# EAGLE design Jacdac_3D_Magnetometer-RevB (EAGLE 9.6.2)
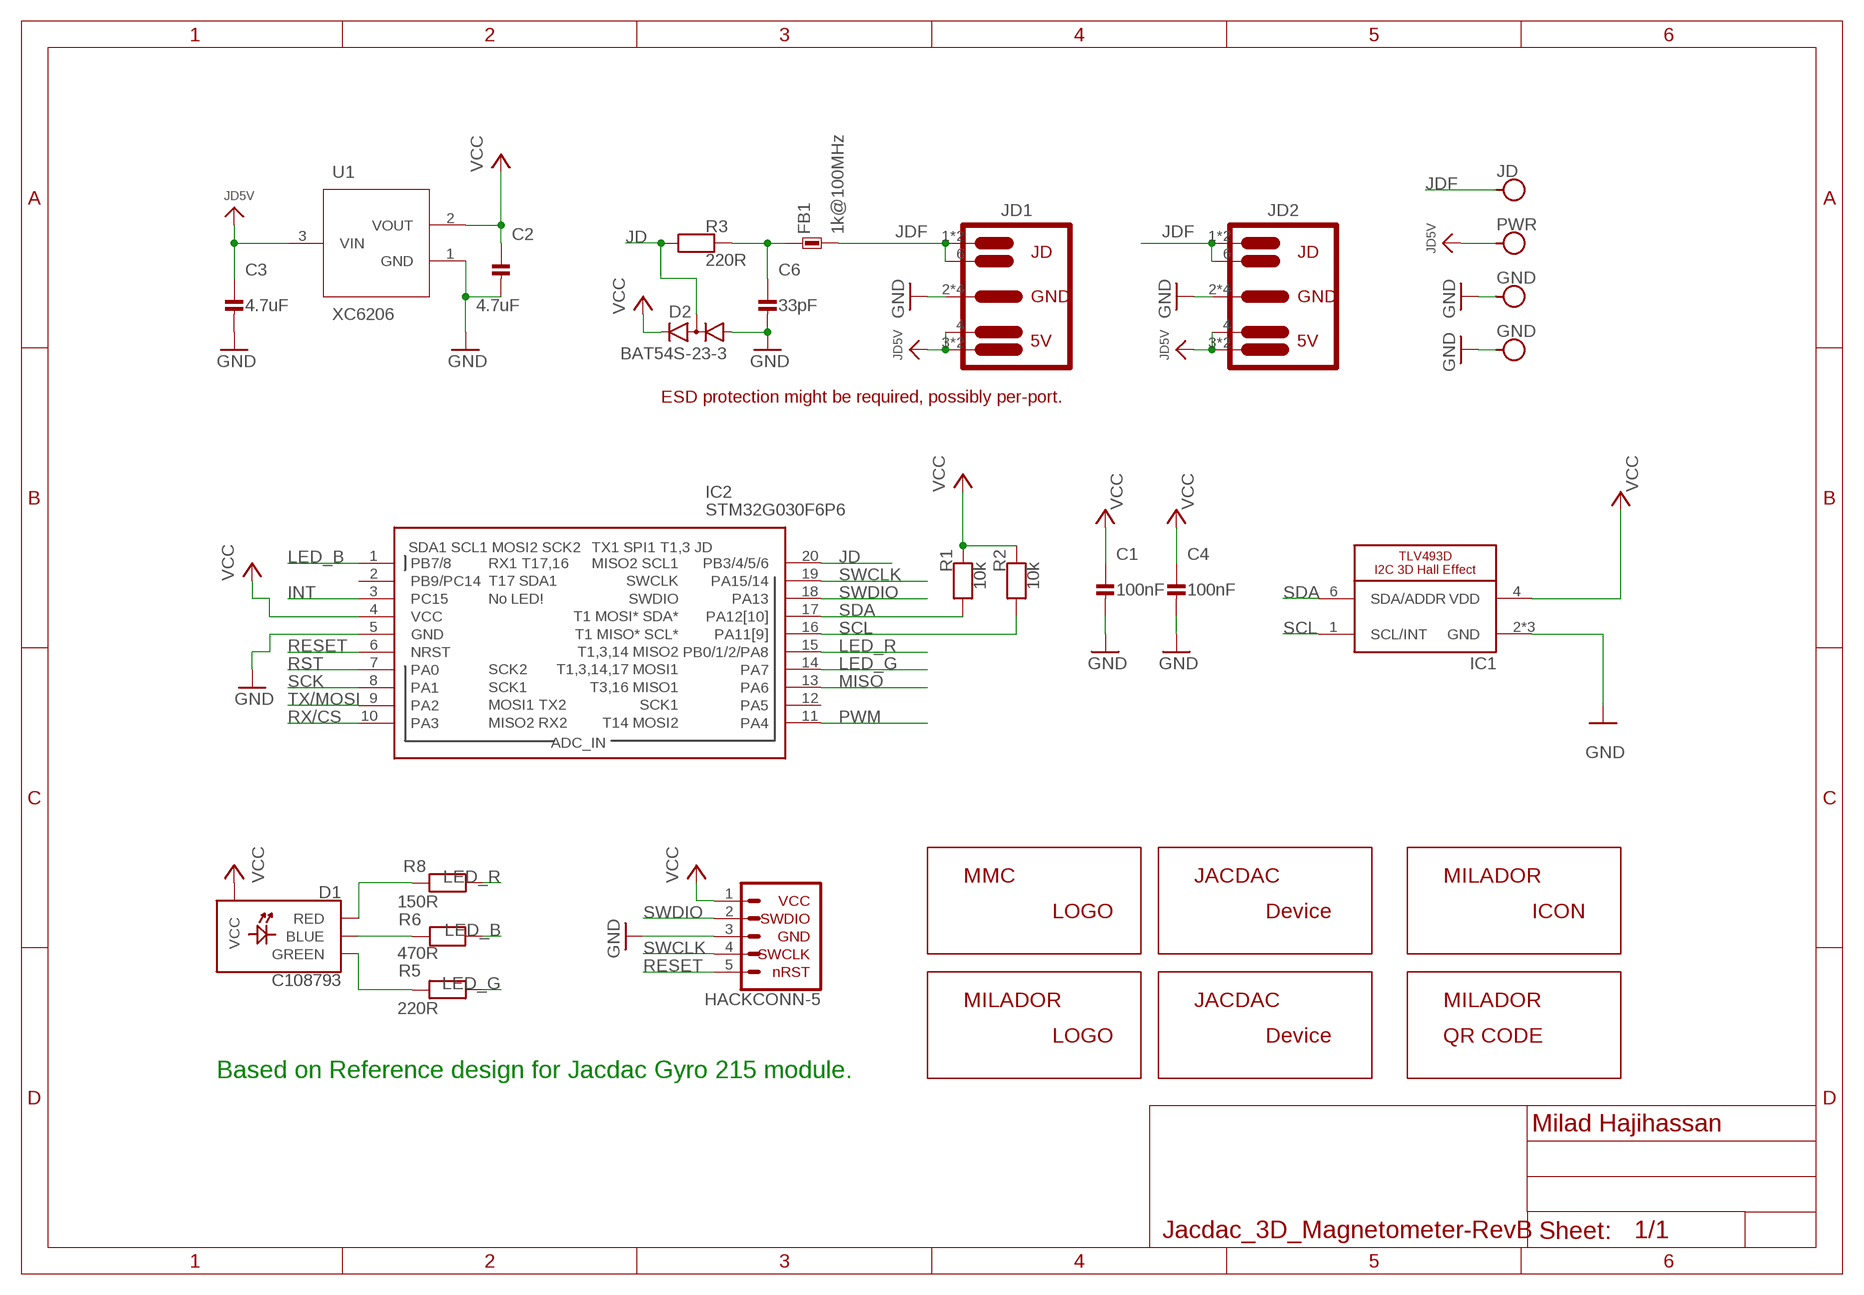
[diagram p0: schematic, sheet 1]

## Parts
C1  100nF  CAP_CERAMIC-0402  [0402]
C2  4.7uF  CAP_CERAMIC-0402  [0402]
C3  4.7uF  CAP_CERAMIC-0402  [0402]
C4  100nF  CAP_CERAMIC-0402  [0402]
C6  33pF  CAP_CERAMIC-0402  [0402]
D1  C108793  LED-RGB-2121-CA  [LED-RGB-2121]
D2  BAT54S-23-3  [SOT23-3]
FB1  1k@100MHz  FERRITE-BEAD-0402  [0402]
IC1  TLV493D  [SOT23-6]
IC2  STM32G030F6P6  STM32G030F8P6  [SOP65P640X120-20N]
J1  JD  JACDAC-M3-DATA  [M3-HOLE-DATA]
J2  PWR  JACDAC-M3-PWR  [M3-HOLE-PWR]
J3  GND  JACDAC-M3-GND  [M3-HOLE-GND]
J4  GND  JACDAC-M3-GND  [M3-HOLE-GND]
J5  HACK-CONNECT-5  [HC5-22-62]
JD1  JACDAC-EDGE-OUTIE  [JD-EDGE-OUTIE]
JD2  JACDAC-EDGE-OUTIE  [JD-EDGE-OUTIE]
LABEL_DEVICE  MILADOR-JACDAC-DEVICE-MAGNETOMETER  [JACDAC-3D-MAGNETOMETER]
LABEL_ICON  MILADOR-ICON-MAG  [MILADOR_ICON_MAGNETOMETER]
LABEL_LOGO1  MILADOR-LOGO-SM  [MILADOR_LOGO2]
LABEL_LOGO2  MMC_LOGO-XSM  [MMC_X-SMALL_LOGO]
LABEL_QRCODE  MILADOR-QR-CODE-JACDAC-MAGNETOMETER  [MILADOR_QR_JACDAC_MAGNETOMETER]
LABEL_TLV493D  MILADOR-JACDAC-DEVICE-TLV493D  [JACDAC-TLV493D]
R1  10k  RESISTOR-0402  [0402]
R2  10k  RESISTOR-0402  [0402]
R3  220R  RESISTOR-0402  [0402]
R5  220R  RESISTOR-0402  [0402]
R6  470R  RESISTOR-0402  [0402]
R8  150R  RESISTOR-0402  [0402]
U1  XC6206  [SOT23-3-W]

## Nets
GND [gnd]: C1.2 C2.2 C3.2 C4.2 C6.2 D2.1(A1) IC1.2(GND) IC1.3(GND) IC1.5(GND) IC2.5(GND) J3.H J4.H J5.3(GND) JD1.2 JD1.5 JD1.P$2 JD1.P$4 JD2.2 JD2.5 JD2.P$2 JD2.P$4 U1.1(GND)
INT: IC2.3(PC15)
JD: D2.3(C1A2) IC2.20(PB3/4/5/6) R3.1
JD5V [usbvcc]: C3.1 J2.H JD1.3 JD1.4 JD1.P$1 JD2.3 JD2.4 JD2.P$1 U1.3(VIN)
JDF: FB1.2 J1.H JD1.1 JD1.6 JD1.P$3 JD2.1 JD2.6 JD2.P$3
LED_B: IC2.1(PB7/8) R6.1
LED_G: IC2.14(PA7) R5.1
LED_R: IC2.15(PB0/1/2/PA8) R8.1
MISO: IC2.13(PA6)
N$1: C6.1 FB1.1 R3.2
N$2: D1.B-(BLUE) R6.2
N$3: D1.R-(RED) R8.2
N$4: D1.G-(GREEN) R5.2
PWM: IC2.11(PA4)
RESET: IC2.6(NRST) J5.5(NRST)
RST: IC2.7(PA0)
RX/CS: IC2.10(PA3)
SCK: IC2.8(PA1)
SCL: IC1.1(SCL/INT) IC2.16(PA11[9]) R2.1
SDA: IC1.6(SDA/ADDR) IC2.17(PA12[10]) R1.1
SWCLK: IC2.19(PA15/14) J5.4(SWCLK)
SWDIO: IC2.18(PA13) J5.2(SWDIO)
TX/MOSI: IC2.9(PA2)
VCC: C1.1 C2.1 C4.1 D1.PLUS(VCC) D2.2(C2) IC1.4(VDD) IC2.4(VCC) J5.1(VCC) R1.2 R2.2 U1.2(VOUT)
Unconnected: IC2.2(PB9/PC14) IC2.12(PA5)

## Notes on the sheet
- ESD protection might be required, possibly per-port.
- Based on Reference design for Jacdac Gyro 215 module.
- Milad Hajihassan

## Library data of the parts
C1-C4 C6 = milador_SMD:CAP_CERAMIC-: Ceramic Capacitors For new designs, use the packages preceded by an '_' character since they are more reliable: The following footprints should be used on most boards: _0402 - Standard footprint for regular board layouts _0603 - Standard footprint for regular board layouts _0805 - Standard footprint for regular board layouts _1206 - Standard footprint for regular board layouts For extremely tight-pitch boards where space is at a premium, the following 'micro-pitch' footprints can be used (smaller pads, no silkscreen outline, etc.): _0402MP - Micro-pitch footprint for very dense/compact boards _0603MP - Micro-pitch footprint for very dense/compact boards _0805MP - Micro-pitch footprint for very dense/compact boards _1206MP - Micro-pitch footprint for very dense/compact boards
D1 = milador_SMD:LED-RGB-2121-CA: RGB LED, common anode
D2 = milador_SMD:BAT54S: B54S two Schottky Diodes JLC408389 ALT: JLC 47546
FB1 = milador_SMD:FERRITE-BEAD-: Ferrite Beads
IC1 = milador_SMD:TLV493D
IC2 = milador_SMD:STM32G030F8P6: STM32G030F6P6 TSSOP-20 JLC724040
J1-J4 = milador:JACDAC-M3: Jacdac mounting Hole M3
J5 = milador:HACK-CONNECT-5
JD1 JD2 = milador:JACDAC-EDGE
LABEL_DEVICE LABEL_TLV493D = milador:MILADOR-JACDAC-DEVICE-
LABEL_ICON = milador:MILADOR-ICON-
LABEL_LOGO1 = milador:MILADOR-LOGO-
LABEL_LOGO2 = MMC Eagle:MMC_LOGO-
LABEL_QRCODE = milador:MILADOR-QR-CODE-
R1-R3 R5 R6 R8 = milador_SMD:RESISTOR-: Resistors For new designs, use the packages preceded by an '_' character since they are more reliable: The following footprints should be used on most boards: _0402 - Standard footprint for regular board layouts _0603 - Standard footprint for regular board layouts _0805 - Standard footprint for regular board layouts _1206 - Standard footprint for regular board layouts For extremely tight-pitch boards where space is at a premium, the following 'micro-pitch' footprints can be used (smaller pads, no silkscreen outline, etc.): _0402MP - Micro-pitch footprint for very dense/compact boards _0603MP - Micro-pitch footprint for very dense/compact boards _0805MP - Micro-pitch footprint for very dense/compact boards _1206MP - Micro-pitch footprint for very dense/compact boards
U1 = milador_SMD:XC6206

## Net classes
0 default: width 0.152 mm
1 power: width 0.152 mm
2 gnd: width 0.152 mm
3 usbvcc: width 0.305 mm

## Board
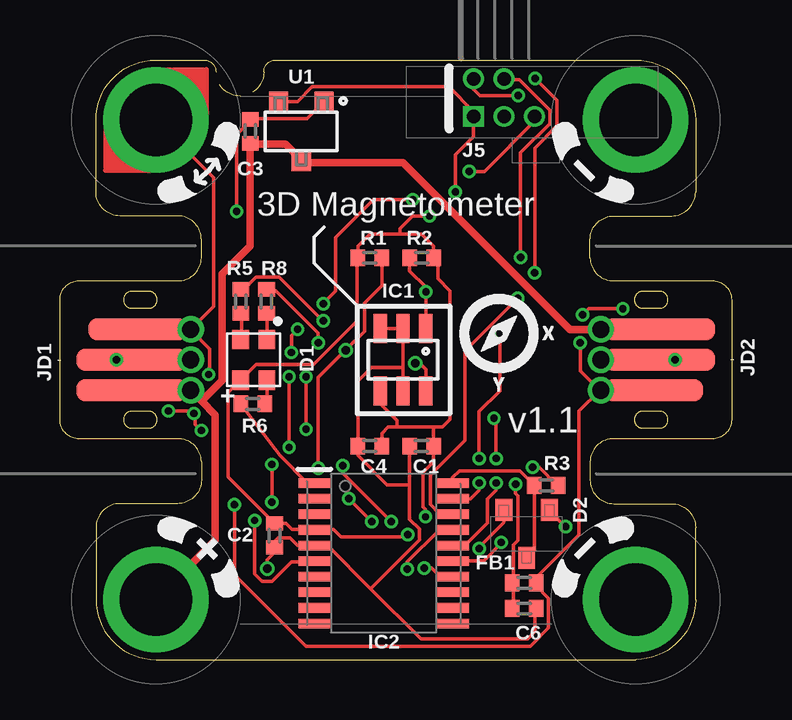
[diagram p1: board, top side]
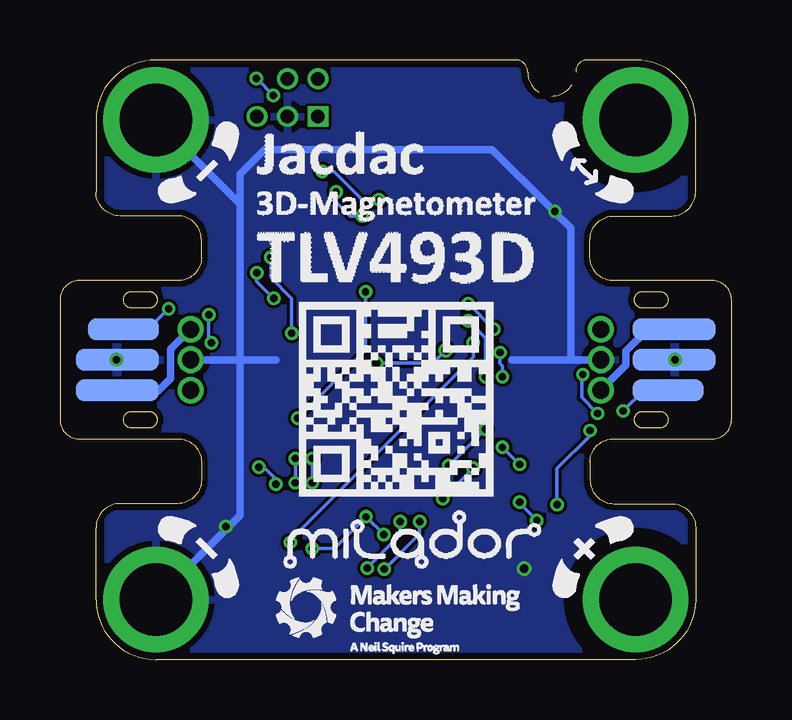
[diagram p2: board, bottom side, seen from below]

Size 28 x 25 mm. Coordinates in mm from the lower left corner, seen from the top.
Outline: 26.5,5.5 26.5,2.5 arc-90 24,0 4,0 arc-90 1.5,2.5 1.5,5.5
Outline: 1.5,19.5 1.5,22.5 arc-90 4,25 6,25 arc-90 6.5,24.5 arc90 7.5,23.5 arc90 8.5,24.5 arc-90 9,25 24,25 arc-90 26.5,22.5 26.5,19.5
Copper layers (1*16): Top 0.035559375mm / dielectric 1.6mm / Bottom 0.035559375mm
Design rules "jlcpcb": minimum track width 5mil, minimum drill 12mil, track to track 5mil, track to pad 5mil, pad to pad 5mil, via to via 5mil, smd to smd 5mil, copper to edge 10mil, drill to drill 8mil, minimum pad ring 5mil, minimum via ring 5mil, stop-mask expansion 2.5mil, vias tented up to drill 30mil, thermal gap 10mil

### Footprints (pad centres in the part's own frame; a part is rotated, then mirrored left to right if it is on the bottom)
0402 = smd 0.6 x 0.7: 1 -0.5,0; 2 0.5,0
LED-RGB-2121 = smd 0.8 x 0.7: B- 0.85,0.55; G- -0.85,-0.55; PLUS 0.85,-0.55; R- -0.85,0.55
SOT23-3 = smd 0.9 x 0.7: 1 1,-0.95; 2 1,0.95; 3 -1,0
SOT23-6 = smd 0.55 x 1.2: 1 -0.95,-1.3; 2 0,-1.3; 3 0.95,-1.3; 4 0.95,1.3; 5 0,1.3; 6 -0.95,1.3
SOP65P640X120-20N = smd 0.4 x 1.35: 1 -2.925,-2.875; 2 -2.275,-2.875; 3 -1.625,-2.875; 4 -0.975,-2.875; 5 -0.325,-2.875; 6 0.325,-2.875; 7 0.975,-2.875; 8 1.625,-2.875; 9 2.275,-2.875; 10 2.925,-2.875; 11 2.925,2.875; 12 2.275,2.875; 13 1.625,2.875; 14 0.975,2.875; 15 0.325,2.875; 16 -0.325,2.875; 17 -0.975,2.875; 18 -1.625,2.875; 19 -2.275,2.875; 20 -2.925,2.875
M3-HOLE-DATA = drill 3.03 pad 4.4: H 0,0
M3-HOLE-PWR = drill 3.03 pad 4.4: H 0,0
M3-HOLE-GND = drill 3.03 pad 4.4: H 0,0
HC5-22-62 = drill 0.559 pad 0.864 square: 1 0,0 | drill 0.559 pad 0.864: 2 0,1.575; 3 1.27,0; 4 1.27,1.575; 5 2.54,0
JD-EDGE-OUTIE = smd 0.9 x 4.1: 1 1.27,-3.25 | smd 0.9 x 4.6: 2 0,-3; 3 -1.27,-3 | smd 0.9 x 3.45 bottom: 4 1.27,-2.4; 5 0,-2.4 | smd 0.9 x 2.95 bottom: 6 -1.27,-2.65 | drill 0.71 pad 1.1: P$1 -1.27,-5.45; P$2 0,-5.45; P$3 1.27,-5.45 | drill 0.305 pad 0.559: P$4 0,-2.35
SOT23-3-W = smd 0.9 x 0.8: 1 1.2,-0.95; 2 1.2,0.95; 3 -1.2,0

### Placement (x,y rotation side)
C1  15.08,8.9 180 top
C2  8.95,5.18 270 top
C3  7.93,22.03 90 top
C4  12.92,8.9 180 top
C6  19.35,2.13 0 top
D1  8.08,12.5 270 top
D2  19.46,5.24 90 top
FB1  19.35,3.2 0 top
IC1  14.3,12.5 180 top
IC2  13.49,4.43 270 top
J1  4,22.5 0 top
J2  4,2.5 0 top
J3  24,2.5 0 top
J4  24,22.5 90 top
J5  17.24,22.64 0 top
JD1  0,12.5 90 top
JD2  28,12.5 270 top
LABEL_DEVICE  14,19.8 0 bottom
LABEL_ICON  18.3,13.6 0 top
LABEL_LOGO1  14,4.5 0 bottom
LABEL_LOGO2  14,0.25 0 bottom
LABEL_QRCODE  14,6.8 0 bottom
LABEL_TLV493D  14,16.75 0 bottom
R1  12.92,16.75 180 top
R2  15.08,16.75 0 top
R3  20.27,7.26 0 top
R5  7.54,14.94 270 top
R6  8.03,10.66 0 top
R8  8.61,14.94 270 top
U1  10.06,22.02 90 top

### Tracks (layer width: path | path; a pad name or v marks a point on that pad's centre or on a via)
GND  (via drill 0.3, 0.35)
  Top 0.152: JD1.P$2 JD1.2 JD1.P$4 | JD2.P$2 JD2.2 JD2.P$4 | U1.1 10.97,23.22 10.31,22.55 7.98,22.55 C3.2 7.92,22.45 7.37,21.89 v7.37,18.69 | v21.08,5.54 20.42,6.2 D2.1 | 12.95,2.95 11.18,4.73 10.67,4.73 IC2.5 9.91,4.76 9.59,5.08 9.09,5.08 8.95,4.94 C2.2 8.95,4.47 8.64,4.16 v8.64,3.8 | 12.95,2.95 15.04,0.86 19.51,0.86 19.81,1.17 19.81,2.13 C6.2 | 12.95,2.95 14.99,4.99 14.99,5.44 14.58,5.85 14.58,7.29 | C1.2 14.58,7.29 | 14.58,7.29 13.64,7.29 12.42,8.51 C4.2 12.42,11.61 12.99,12.18 14.3,12.18 | 14.3,12.18 IC1.5 | 14.3,12.18 IC1.2 IC1.3
  Bottom 0.152: v21.08,5.54 21.02,5.48 | v7.37,18.69 7.42,18.75 7.47,18.75
  Bottom 0.305: JD1.P$2 6.71,12.5 | 6.71,12.5 9.14,12.5 9.16,12.49 | JD2.P$2 19,12.5 | J3.H 21.02,5.48 20.5,6 20.5,18.75 | J4.H 20.5,19 20.5,18.75 | 6.71,12.5 6.71,17.98 7.47,18.75 7.62,18.9 9.98,21.26 19.48,21.26 20.5,20.23 20.5,18.75
  pour Bottom: 2,25 2,0 26,0 26,25
JD
  Top 0.152: D2.3 19.77,4.56 R3.1 19.18,7.86 19.17,7.87 16.65,7.87 16.37,7.59 IC2.20
JD5V
  Top 0.305: J2.H 6.31,4.81 6.48,4.98 6.48,10.2 5.9,10.78 | 5.9,10.78 JD1.P$1 5.33,11.23 3.05,11.23 JD1.3 | JD2.3 JD2.P$1 21.26,13.77 14.3,20.73 10.16,20.73 U1.3 9.4,21.49 7.98,21.49 C3.1 7.92,21.34 7.92,17.23 6.76,16.06 6.76,11.63 5.9,10.78
  Bottom 0.305: JD1.P$1 4.4,12.28 4.4,12.86 3.49,13.77 JD1.4 | JD2.P$1 23.38,12.94 23.38,11.72 23.91,11.19 25.56,11.19 JD2.4
JDF  (via drill 0.3)
  Top 0.152: J1.H 6.4,20.1 6.4,17.42 6.4,14.72 JD1.P$3 5.49,13.72 6.25,12.95 6.25,12.19 6.2,12.14 v6.2,11.89 | v4.52,10.36 5.49,10.36 v5.59,10.26 5.64,10.21 5.64,9.8 v5.89,9.55 | v23.47,14.63 22.05,14.63 v21.79,14.38 | v21.69,13.21 21.69,12.04 22.45,11.28 JD2.P$3 22.5,11.23 21.64,10.36 21.64,5.2 19.86,3.42 FB1.2 19.86,3.08 20.37,2.56 20.37,1.32 19.61,0.56 10.25,0.56 7.27,3.54 v7.27,6.46
  Bottom 0.152: v4.52,10.36 3.66,11.23 2.69,11.23 JD1.6 | v5.59,10.26 6.25,10.92 6.25,11.84 v6.2,11.89 | v23.47,14.63 24.28,13.82 25.35,13.82 JD2.6 | v21.79,14.38 21.79,13.31 v21.69,13.21 | v5.89,9.55 5.89,9.35 7.27,7.97 v7.27,6.46
LED_B
  Top 0.152: R6.1 9.17,8.52 10.31,7.37 10.62,7.37 IC2.1
LED_G  (via drill 0.3)
  Top 0.152: v10.97,14.12 9.14,15.95 8.18,15.95 7.67,15.44 7.57,15.44 R5.1 | v10.26,9.61 v10.26,11.79 | v11.79,8.09 11.79,7.78 v13.82,5.75 | v15.19,3.82 15.49,3.82 15.85,3.46 16.36,3.46 IC2.14
  Bottom 0.152: v10.97,14.12 10.26,13.41 v10.26,11.79 | v11.79,8.09 v10.26,9.61 | v13.82,5.75 13.82,5.19 v15.19,3.82
LED_R  (via drill 0.3)
  Top 0.152: v10.77,13.21 10.77,13.61 8.99,15.39 8.64,15.39 R8.1 | v18.39,4.88 18.39,4.83 17.68,4.12 16.41,4.12 IC2.15
  Bottom 0.152: v10.77,13.21 10.77,12.61 18.39,4.99 v18.39,4.88
N$1  (via drill 0.3)
  Top 0.152: C6.1 18.9,2.13 18.9,3.2 FB1.1 18.9,3.25 18.9,4.78 19.1,4.98 19.1,6.82 19,6.92 v19,7.32 | v19.71,8.03 19.96,8.03 20.73,7.26 R3.2
  Bottom 0.152: v19,7.32 19,7.53 19.5,8.03 v19.71,8.03
N$2
  Top 0.152: R6.2 8.64,10.82 8.64,11.63 D1.B-
N$3
  Top 0.152: R8.2 8.64,14.43 D1.R-
N$4
  Top 0.152: R5.2 7.57,14.43 7.57,13.36 D1.G-
RESET  (via drill 0.3)
  Top 0.152: v8.12,5.8 8.12,3.57 8.43,3.26 8.84,3.26 9.65,4.07 10.62,4.07 IC2.6 | v8.84,8.14 v8.84,6.56 | v9.55,11.79 v9.55,8.85 | v9.65,12.8 9.65,13.51 v9.91,13.77 | v10.97,14.83 11.49,15.36 11.49,17.6 13.07,19.18 v14.71,19.18 | v17.07,20.35 17.69,20.35 19.78,22.44 J5.5
  Bottom 0.152: v8.84,6.56 8.84,6.52 v8.12,5.8 | v9.55,8.85 v8.84,8.14 | v9.55,11.79 9.55,12.24 9.65,12.34 v9.65,12.8 | v10.97,14.83 v9.91,13.77 | v14.71,19.18 15.4,19.18 16.57,20.35 v17.07,20.35
SCL  (via drill 0.3)
  Top 0.152: v18.19,7.37 18.19,7.06 17.83,6.7 17.83,5.7 16.92,4.78 16.41,4.78 IC2.16 | v18.19,8.38 18.19,9.97 v18.09,10.06 | R2.1 14.58,16.2 15.26,15.52 v15.26,15.34 IC1.1
  Bottom 0.152: v18.19,8.38 v18.19,7.37 | v18.09,10.06 15.26,12.9 v15.26,15.34
SDA  (via drill 0.3, 0.35)
  Top 0.152: v10.77,7.98 10.77,11.76 v11.91,12.9 12.7,13.68 12.7,14.87 13.42,15.6 R1.1 | v13.01,5.75 v12.04,6.71 | v14.48,3.77 14.48,4.07 15.8,5.39 16.36,5.39 IC2.17 | IC1.6 15.25,12.1 14.99,12.36 v14.8,12.36
  Bottom 0.152: v12.04,6.71 v10.77,7.98 | v13.01,5.75 13.01,5.24 v14.48,3.77 | v14.8,12.36 12.45,12.36 v11.91,12.9
SWCLK  (via drill 0.3)
  Top 0.152: v17.48,8.38 17.48,10.34 18.34,11.21 v18.34,13.61 | v19.2,16.77 19.2,21.13 20.42,22.35 20.42,22.91 19.15,24.18 18.54,24.18 J5.4 | v17.48,7.37 17.48,7.06 17.12,6.71 IC2.19
  Bottom 0.152: v17.48,8.38 v17.48,7.37 | v18.34,13.61 18.34,15.06 19.2,15.93 v19.2,16.77
SWDIO  (via drill 0.3)
  Top 0.152: v19.79,16.13 19.79,21.32 20.73,22.25 20.73,23.32 v19.81,24.23 | v19.1,23.52 v19.09,23.51 17.51,23.51 17.24,23.77 J5.2 | IC2.18 16.36,6.1 15.8,6.1 15.44,6.46 15.44,7.69 16.89,9.14 16.89,12.87 19,14.96 19,14.97 v19.09,15.06
  Bottom 0.152: v19.79,16.13 19.79,15.77 v19.09,15.06 | v19.1,23.52 v19.81,24.23
VCC  (via drill 0.3)
  Top 0.152: U1.2 9.14,23.27 9.91,23.27 10.52,23.88 16.21,23.88 17.24,22.84 J5.1 17.24,22.53 17.24,22.54 17.24,21.8 16.49,21.05 v16.49,19.5 | v17.48,4.63 17.48,4.68 18.49,5.7 18.51,5.74 D2.2 | v15.24,5.95 15.24,6.26 15.14,6.36 15.14,7.81 15.58,8.25 C1.1 15.58,9.69 | 14.18,17.74 12.93,17.74 12.42,17.23 R1.2 12.39,16.44 12.39,14.12 10.57,12.29 8.18,12.29 7.57,11.68 D1.PLUS 7.52,11.63 7.01,11.12 7.01,7.62 C2.1 9.42,5.68 9.67,5.43 10.6,5.43 | 14.18,17.74 15.07,17.74 15.58,17.23 R2.2 15.75,16.57 15.75,15.88 16.27,15.36 16.27,10.02 15.94,9.69 15.58,9.69 | v15.4,18.49 14.7,18.49 14.18,17.97 14.18,17.74 | v14.5,5.21 14.41,5.12 11.72,5.12 11.41,5.43 10.6,5.43 | IC2.4 10.6,5.42 10.6,5.43 | 14.05,9.69 13.69,9.69 13.43,9.43 13.42,9.43 C4.1 | 14.05,9.69 15.58,9.69 | IC1.4 13.35,10.67 14.05,9.96 14.05,9.69
  Bottom 0.152: v17.48,4.63 16.56,4.63 v15.24,5.95 v14.5,5.21 | v15.4,18.49 15.9,18.49 16.49,19.07 v16.49,19.5

### Text on the board
tPlace: 3D Magnetometer | v1.1